# EAGLE design quadlighter-1.1 (EAGLE 5.12)
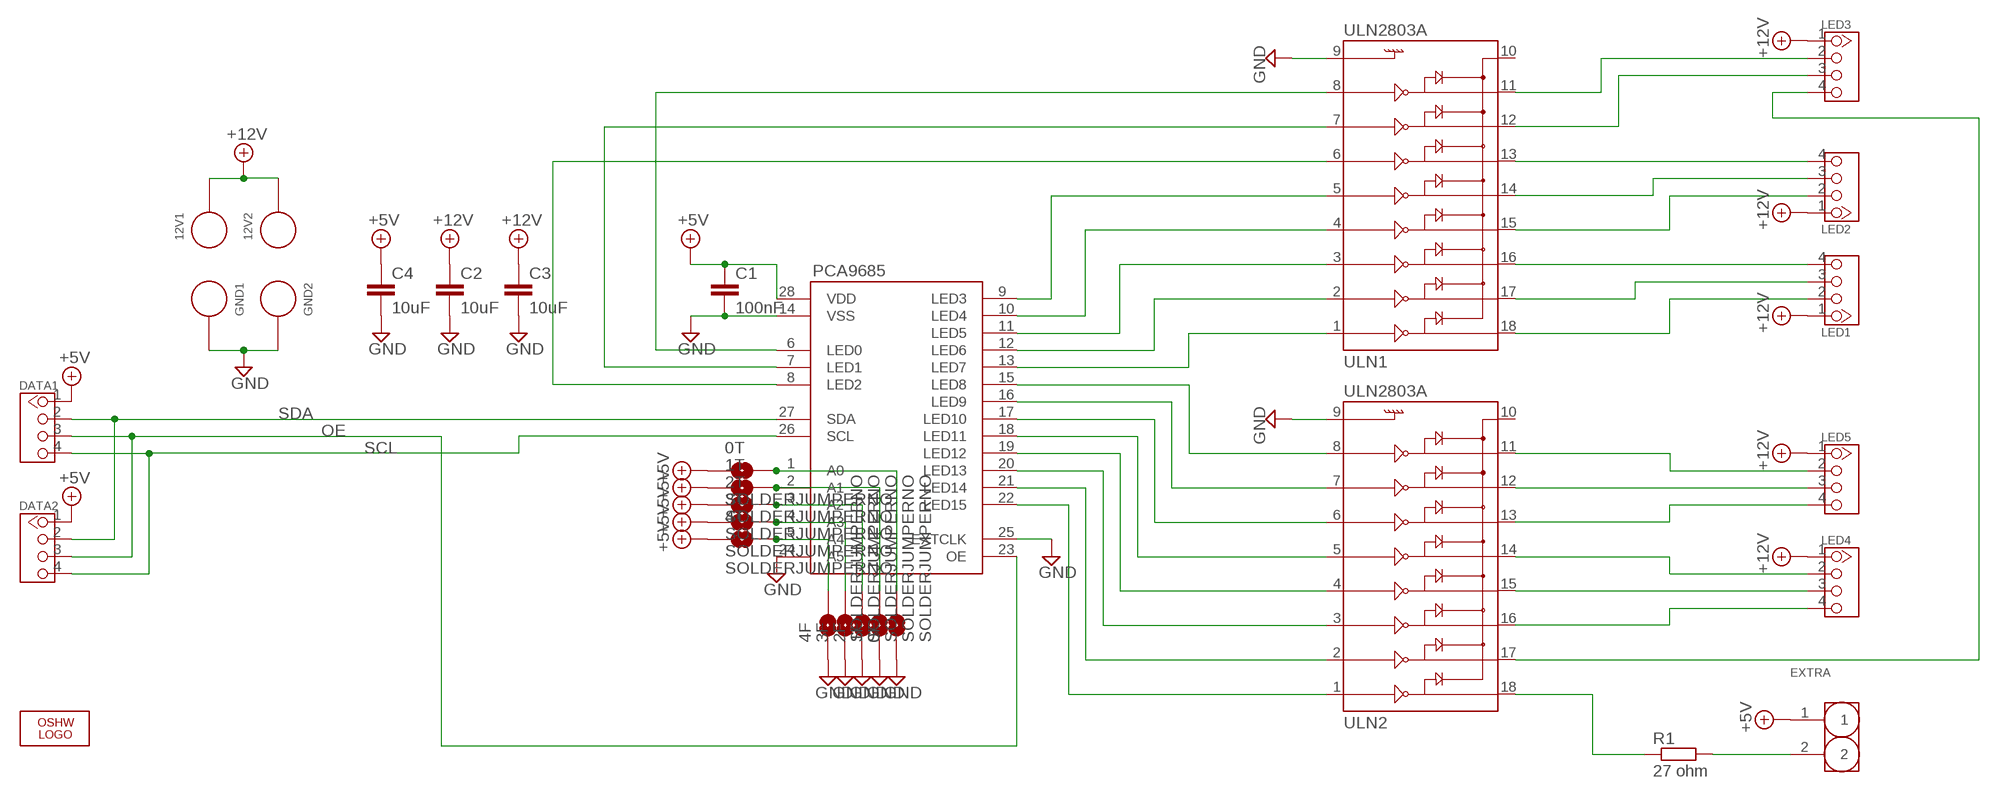
[diagram p0: schematic, sheet 1]

## Parts
0F  SOLDERJUMPERNO  [SJ_2S-NO]
0T  SOLDERJUMPERNO  [SJ_2S-NO]
1F  SOLDERJUMPERNO  [SJ_2S-NO]
1T  SOLDERJUMPERNO  [SJ_2S-NO]
2F  SOLDERJUMPERNO  [SJ_2S-NO]
2T  SOLDERJUMPERNO  [SJ_2S-NO]
3F  SOLDERJUMPERNO  [SJ_2S-NO]
3T  SOLDERJUMPERNO  [SJ_2S-NO]
4F  SOLDERJUMPERNO  [SJ_2S-NO]
4T  SOLDERJUMPERNO  [SJ_2S-NO]
12V1  LARGE_WIRE_PAD  [LARGE_WIRE_PAD_PACK]
12V2  LARGE_WIRE_PAD  [LARGE_WIRE_PAD_PACK]
C1  100nF  C-EUC3216  [C3216]
C2  10uF  C-EUC3216  [C3216]
C3  10uF  C-EUC3216  [C3216]
C4  10uF  C-EUC3216  [C3216]
DATA1  HEADER-4P-80/40MIL  [4P-2.54-80/40MIL]
DATA2  HEADER-4P-80/40MIL  [4P-2.54-80/40MIL]
EXTRA  HEADER-2P-2.54  [2P-2.54]
GND1  LARGE_WIRE_PAD  [LARGE_WIRE_PAD_PACK]
GND2  LARGE_WIRE_PAD  [LARGE_WIRE_PAD_PACK]
LED1  HEADER-4P-80/40MIL  [4P-2.54-80/40MIL]
LED2  HEADER-4P-80/40MIL  [4P-2.54-80/40MIL]
LED3  HEADER-4P-80/40MIL  [4P-2.54-80/40MIL]
LED4  HEADER-4P-80/40MIL  [4P-2.54-80/40MIL]
LED5  HEADER-4P-80/40MIL  [4P-2.54-80/40MIL]
LOGO1  LOGO-OSHW-6MILX0070-NT  [OSHW_6X70_NOTEXT]
PCA9685  PCA9685  [TSSOP28]
R1  27 ohm  R-EU_R1206  [R1206]
ULN1  ULN2803A  ULN2803SOICW  [SO18L]
ULN2  ULN2803A  ULN2803SOICW  [SO18L]

## Nets
+5V: 0T.1 1T.1 2T.1 3T.1 4T.1 C1.1 C4.1 DATA1.1 DATA2.1 EXTRA.1 PCA9685.28(VDD)
+12V: 12V1.P$1 12V2.P$1 C2.1 C3.1 LED1.1 LED2.1 LED3.1 LED4.1 LED5.1
GND: 0F.1 1F.1 2F.1 3F.1 4F.1 C1.2 C2.2 C3.2 C4.2 GND1.P$1 GND2.P$1 PCA9685.14(VSS) PCA9685.24(A5) PCA9685.25(EXTCLK) ULN1.9 ULN2.9
N$1: PCA9685.6(LED0) ULN1.8
N$2: PCA9685.7(LED1) ULN1.7
N$3: PCA9685.8(LED2) ULN1.6
N$4: PCA9685.9(LED3) ULN1.5
N$5: PCA9685.10(LED4) ULN1.4
N$6: PCA9685.11(LED5) ULN1.3
N$7: PCA9685.12(LED6) ULN1.2
N$8: PCA9685.13(LED7) ULN1.1
N$9: LED4.3 ULN2.15
N$10: LED5.3 ULN2.12
N$12: PCA9685.15(LED8) ULN2.8
N$13: PCA9685.16(LED9) ULN2.7
N$14: PCA9685.17(LED10) ULN2.6
N$15: PCA9685.18(LED11) ULN2.5
N$16: PCA9685.19(LED12) ULN2.4
N$17: PCA9685.20(LED13) ULN2.3
N$18: PCA9685.21(LED14) ULN2.2
N$19: PCA9685.22(LED15) ULN2.1
N$20: LED3.2 ULN1.11
N$21: LED2.2 ULN1.15
N$22: LED3.3 ULN1.12
N$23: LED2.4 ULN1.13
N$24: LED2.3 ULN1.14
N$25: 0F.2 0T.2 PCA9685.1(A0)
N$26: 1F.2 1T.2 PCA9685.2(A1)
N$27: 2F.2 2T.2 PCA9685.3(A2)
N$28: 3F.2 3T.2 PCA9685.4(A3)
N$29: 4F.2 4T.2 PCA9685.5(A4)
N$30: LED1.4 ULN1.16
N$31: LED3.4 ULN2.17
N$32: LED1.3 ULN1.17
N$33: EXTRA.2 R1.2
N$34: LED1.2 ULN1.18
N$35: R1.1 ULN2.18
N$36: LED4.4 ULN2.16
N$37: LED5.4 ULN2.13
N$38: LED4.2 ULN2.14
N$39: LED5.2 ULN2.11
OE: DATA1.3 DATA2.3 PCA9685.23(OE)
SCL: DATA1.4 DATA2.4 PCA9685.26(SCL)
SDA: DATA1.2 DATA2.2 PCA9685.27(SDA)
Unconnected: ULN1.10 ULN2.10

## Library data of the parts
0F 0T 1F 1T 2F 2T 3F 3T 4F 4T = SparkFun:SOLDERJUMPER: Solder Jumper Standard SMD solder jumper. Used to automate production. Two varients : Normally Open and Normally Closed are the same, but have different paste layers. NC will have a large amount of paste and should jumper during reflow.
12V1 12V2 GND1 GND2 = zzorn:LARGE_WIRE_PAD
C1-C4 = rcl:C-EU: CAPACITOR, European symbol
DATA1 DATA2 LED1-LED5 = Connector:HEADER-4P
EXTRA = Connector:HEADER-2P
LOGO1 = Logo:LOGO-OSHW-6MIL
PCA9685 = mylib:PCA9685
R1 = rcl:R-EU_: RESISTOR, European symbol
ULN1 ULN2 = SparkFun:ULN2803: Darlington Driver ULN2803 Darlington array. 500mA max per channel, 8-channel package. Spark Fun Electronics SKU : COM-00312

## Board
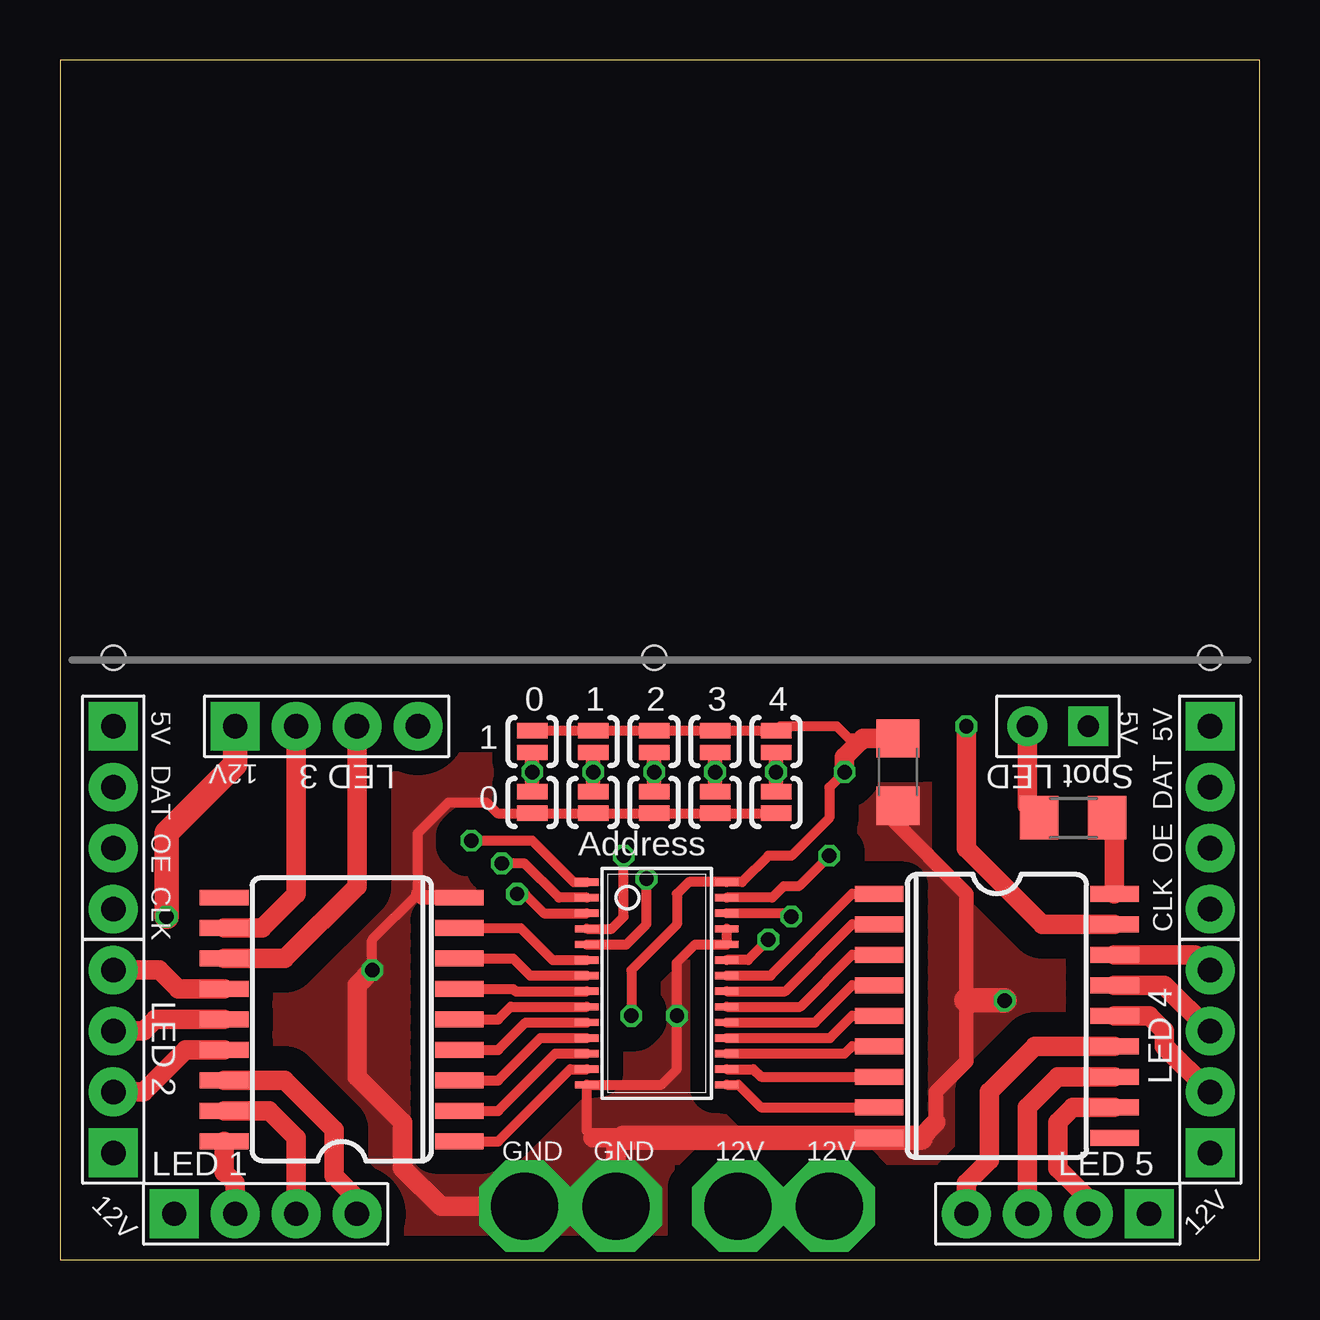
[diagram p1: board, top side]
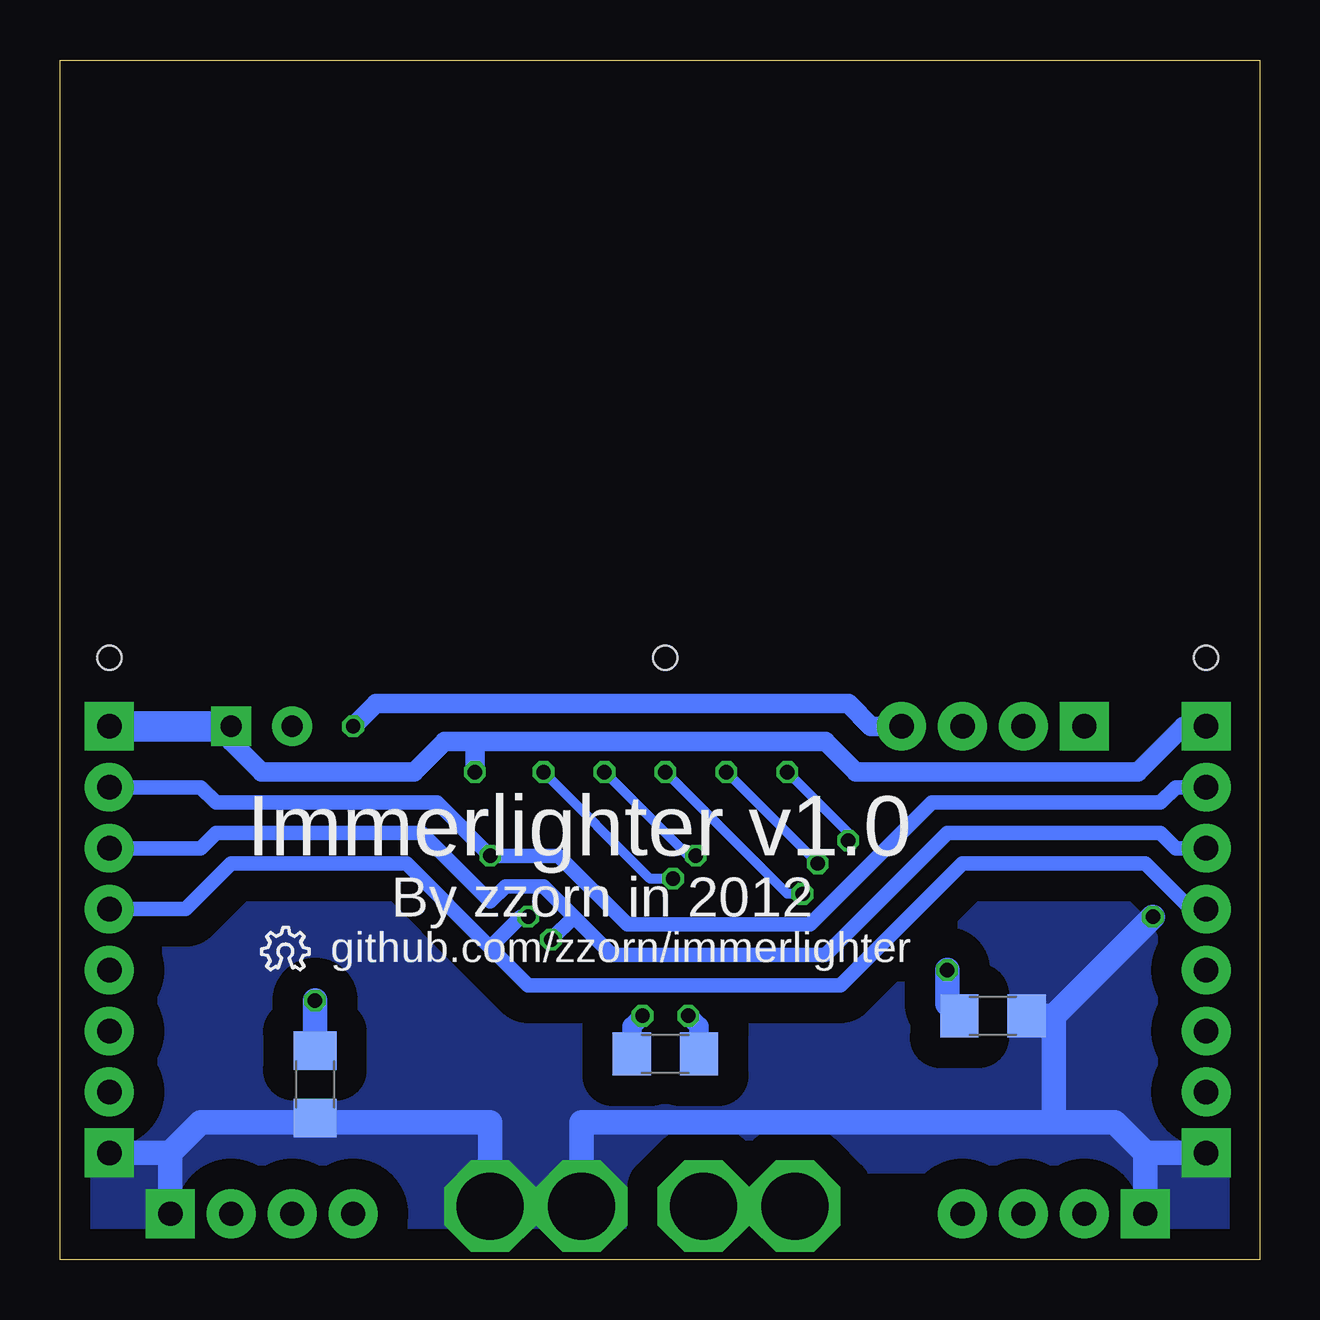
[diagram p2: board, bottom side, seen from below]

Size 50 x 50 mm. Coordinates in mm from the lower left corner, seen from the top.
Outline: 0,0 50,0 50,50 0,50 0,0
Copper layers (1*16): Top 0.035mm / dielectric 1.5mm / Bottom 0.035mm
Design rules "Fusion_eagle_rule_v1.1": minimum track width 6mil, minimum drill 12mil, track to track 6mil, track to pad 6mil, pad to pad 6mil, via to via 6mil, smd to smd 0mil, copper to edge 10mil, drill to drill 10mil, minimum pad ring 10mil, minimum via ring 6mil, stop-mask expansion 2mil, vias tented up to drill 100mil, thermal gap 10mil
Holes 1 mm at 2.22,25.08 24.77,25.08 47.94,25.08

### Footprints (pad centres in the part's own frame; a part is rotated, then mirrored left to right if it is on the bottom)
SJ_2S-NO = smd 0.635 x 1.27: 1 -0.45,0; 2 0.45,0
LARGE_WIRE_PAD_PACK = drill 2.8 pad 3.81 octagon: P$1 0,0
C3216 = smd 1.6 x 1.8: 1 -1.4,0; 2 1.4,0
4P-2.54-80/40MIL = drill 1.016 pad 2.032 square: 1 0,3.81 | drill 1.016 pad 2.032 round: 2 0,1.27; 3 0,-1.27; 4 0,-3.81
2P-2.54 = drill 0.889 pad 1.651 square: 1 0,1.27 | drill 0.889 pad 1.651 round: 2 0,-1.27
TSSOP28 = smd 0.305 x 0.991: 1 -4.225,-2.918; 2 -3.575,-2.918; 3 -2.925,-2.918; 4 -2.275,-2.918; 5 -1.625,-2.918; 6 -0.975,-2.918; 7 -0.325,-2.918; 8 0.325,-2.918; 9 0.975,-2.918; 10 1.625,-2.918; 11 2.275,-2.918; 12 2.925,-2.918; 13 3.575,-2.918; 14 4.225,-2.918; 15 4.225,2.918; 16 3.575,2.918; 17 2.925,2.918; 18 2.275,2.918; 19 1.625,2.918; 20 0.975,2.918; 21 0.325,2.918; 22 -0.325,2.918; 23 -0.975,2.918; 24 -1.625,2.918; 25 -2.275,2.918; 26 -2.925,2.918; 27 -3.575,2.918; 28 -4.225,2.918
R1206 = smd 1.6 x 1.803: 1 -1.422,0; 2 1.422,0
SO18L = smd 0.66 x 2.032: 1 -0.635,-4.902; 2 0.635,-4.902; 3 1.905,-4.902; 4 3.175,-4.902; 5 4.445,-4.902; 6 5.715,-4.902; 7 6.985,-4.902; 8 8.255,-4.902; 9 9.525,-4.902; 10 9.525,4.902; 11 8.255,4.902; 12 6.985,4.902; 13 5.715,4.902; 14 4.445,4.902; 15 3.175,4.902; 16 1.905,4.902; 17 0.635,4.902; 18 -0.635,4.902

### Placement (x,y rotation side)
0F  19.68,19.05 90 top
0T  19.68,21.59 270 top
1F  22.23,19.05 90 top
1T  22.23,21.59 270 top
2F  24.77,19.05 90 top
2T  24.77,21.59 270 top
3F  27.3,19.05 90 top
3T  27.3,21.59 270 top
4F  29.84,19.05 90 top
4T  29.84,21.59 270 top
12V1  32.07,2.22 0 top
12V2  28.26,2.22 0 top
C1  24.77,8.57 180 bottom
C2  39.37,7.3 90 bottom
C3  11.11,10.16 180 bottom
C4  34.92,20.32 270 top
DATA1  2.22,18.41 0 top
DATA2  47.94,18.41 0 top
EXTRA  41.59,22.23 270 top
GND1  19.37,2.22 0 top
GND2  23.18,2.22 0 top
LED1  8.57,1.91 90 top
LED2  2.22,8.26 180 top
LED3  11.11,22.23 90 top
LED4  47.94,8.26 180 top
LED5  41.59,1.91 270 top
LOGO1  41.59,12.06 0 bottom
PCA9685  24.88,11.51 270 top
R1  42.23,18.41 180 top
ULN1  11.75,5.56 90 top
ULN2  39.05,14.61 270 top

### Tracks (layer width: path | path; a pad name or v marks a point on that pad's centre or on a via)
+5V  (via drill 0.6)
  Top 0.406: 0T.1 1T.1 2T.1 3T.1 4T.1 30.03,22.23 32.38,22.23 32.89,21.72 33.21,21.72 33.34,21.59 | v23.81,10.16 23.81,12.06 25.72,13.97 25.72,15.24 26.21,15.73 PCA9685.28 28.43,15.73 29.53,16.83 30.48,16.83 32.07,18.41 32.07,19.68 v32.7,20.32
  Top 0.813: C4.1 33.47,21.72 33.34,21.59 32.7,20.95 v32.7,20.32
  Bottom 0.813: 32.7,21.59 33.97,21.59 35.24,20.32 41.59,20.32 42.86,21.59 EXTRA.1 | 32.7,21.59 18.1,21.59 16.83,20.32 5.08,20.32 3.17,22.23 DATA1.1 | 32.7,21.59 v32.7,20.32 | C1.1 23.36,9.71 v23.81,10.16
  Bottom 1.27: EXTRA.1 DATA2.1
+12V  (via drill 0.6)
  Top 1.016: LED3.1 7.3,20.64 4.45,17.78 v4.45,14.29
  Bottom 0.813: C3.1 9.84,10.29
  Bottom 1.016: 8.57,10.16 v4.45,14.29 | 8.57,10.16 C3.1 | 4.76,4.45 LED1.1 | 4.76,4.45 6.03,5.71 8.26,5.71 | 8.57,10.16 8.57,6.03 8.26,5.71 | 45.4,4.45 LED5.1 | 45.4,4.45 44.13,5.71 39.56,5.71 C2.1 39.18,5.71 32.07,5.71 12V1.P$1 12V2.P$1 28.26,5.71 8.26,5.71 | 45.4,4.45 LED4.1 | LED2.1 4.76,4.45
  pour Bottom (isolate 1.27, no thermals): 0.32,21.27 49.53,21.27 49.21,0 17.46,0 17.46,3.81 12.7,3.81 12.7,0.32 0.32,0.32
GND  (via drill 0.6)
  Top 0.406: 4F.1 3F.1 2F.1 1F.1 0F.1 18.23,18.6 17.78,19.05 16.19,19.05 14.92,17.78 14.92,15.24 13.02,13.34 v13.02,12.06 | 34.6,18.6 C4.2 | 22.23,5.08 21.96,5.34 PCA9685.14 25.07,7.29 25.72,7.94 v25.72,10.16 25.72,12.38 26.47,13.13 PCA9685.24 PCA9685.25
  Top 0.61: 34.6,18.6 34.6,18.42 37.78,15.24 37.78,10.79 37.78,8.26 36.51,6.99 36.51,5.71 | 35.88,5.08 ULN2.9 | ULN1.9 15.08,15.09 14.92,15.24
  Top 0.813: v13.02,12.06 12.38,11.43 12.38,7.62 14.29,5.71 14.29,3.81 15.88,2.22 GND1.P$1 GND2.P$1 23.18,5.08 | 23.18,5.08 22.23,5.08 | 23.18,5.08 23.5,5.08 | 35.88,5.08 36.51,5.71
  Top 1.016: 37.78,10.79 v39.37,10.79 | 23.5,5.08 35.88,5.08
  Bottom 0.813: C1.2 26.16,9.71 v25.72,10.16
  Bottom 1.016: v13.02,12.06 13.02,10.66 C3.2 | v39.37,10.79 C2.2
  pour Top (isolate 1.016, no thermals): 0.32,20.95 49.53,20.95 49.21,0.32 37.78,0.32 37.78,4.13 25.4,4.13 25.4,0 0.32,0
N$1
  Top 0.406: PCA9685.6 20.54,12.48 19.2,13.82 ULN1.8
N$2
  Top 0.406: PCA9685.7 19.6,11.84 18.89,12.55 ULN1.7
N$3
  Top 0.406: PCA9685.8 18.98,11.19 18.89,11.28 ULN1.6
N$4
  Top 0.406: PCA9685.9 18.79,10.54 18.26,10.01 ULN1.5
N$5
  Top 0.406: PCA9685.10 19.41,9.88 18.26,8.74 ULN1.4
N$6
  Top 0.406: PCA9685.11 20.03,9.23 18.26,7.47 ULN1.3
N$7
  Top 0.406: PCA9685.12 20.65,8.59 18.26,6.2 ULN1.2
N$8
  Top 0.406: PCA9685.13 21.27,7.93 18.26,4.93 ULN1.1
N$9
  Top 0.813: ULN2.15 46.04,11.43 LED4.3
N$10
  Top 0.813: ULN2.12 41.59,7.62 40.32,6.35 LED5.3
N$12
  Top 0.406: PCA9685.15 28.27,7.29 29.21,6.35 ULN2.8
N$13
  Top 0.406: PCA9685.16 28.89,7.93 29.21,7.62 ULN2.7
N$14
  Top 0.406: PCA9685.17 32.72,8.59 33.02,8.89 ULN2.6
N$15
  Top 0.406: PCA9685.18 32.09,9.23 33.02,10.16 ULN2.5
N$16
  Top 0.406: PCA9685.19 31.48,9.88 33.02,11.43 ULN2.4
N$17
  Top 0.406: PCA9685.20 30.86,10.54 33.02,12.7 ULN2.3
N$18
  Top 0.406: PCA9685.21 30.23,11.19 33.02,13.97 ULN2.2
N$19
  Top 0.406: PCA9685.22 29.61,11.84 33.02,15.24 ULN2.1
N$20
  Top 0.813: ULN1.11 8.42,13.82 9.84,15.24 LED3.2
N$21
  Top 0.813: ULN1.15 5.24,8.74 3.49,6.99 LED2.2
N$22
  Top 0.813: ULN1.12 9.37,12.55 12.38,15.56 LED3.3
N$23
  Top 0.813: ULN1.13 4.92,11.28 4.13,12.06 LED2.4
N$24
  Top 0.813: ULN1.14 3.97,10.01 3.49,9.53 LED2.3
N$25  (via drill 0.6)
  Top 0.406: PCA9685.1 21.41,15.73 19.68,17.46 v17.14,17.46
  Top 0.61: 0T.2 v19.68,20.32 0F.2
  Bottom 0.406: v17.14,17.46 17.14,17.78 v19.68,20.32
N$26  (via drill 0.6)
  Top 0.406: PCA9685.2 20.79,15.09 19.37,16.51 v18.41,16.51
  Top 0.61: 1T.2 v22.23,20.32 1F.2
  Bottom 0.406: v18.41,16.51 v22.23,20.32
N$27  (via drill 0.6)
  Top 0.406: PCA9685.3 20.17,14.44 19.37,15.24 v19.05,15.24
  Top 0.61: 2T.2 v24.77,20.32 2F.2
  Bottom 0.406: v19.05,15.24 19.68,15.24 v24.77,20.32
N$28  (via drill 0.6)
  Top 0.406: PCA9685.4 22.99,13.79 23.5,14.29 v23.5,16.83
  Top 0.61: 3T.2 v27.3,20.32 3F.2
  Bottom 0.406: v23.5,16.83 23.81,16.83 v27.3,20.32
N$29  (via drill 0.6)
  Top 0.406: PCA9685.5 23.61,13.13 24.45,13.97 v24.45,15.88
  Top 0.61: 4T.2 v29.84,20.32 4F.2
  Bottom 0.406: v24.45,15.88 25.4,15.88 v29.84,20.32
N$30
  Top 0.813: ULN1.16 9.36,7.47 11.43,5.4 11.43,3.49 12.38,2.54 LED1.4
N$31  (via drill 0.6)
  Top 0.813: ULN2.17 40.96,13.97 37.78,17.14 v37.78,22.23
  Bottom 0.813: v37.78,22.23 36.83,23.18 17.14,23.18 16.19,22.23 LED3.4
N$32
  Top 0.813: ULN1.17 8.73,6.2 9.84,5.08 LED1.3
N$33
  Top 0.813: EXTRA.2 40.32,18.9 R1.2
N$34
  Top 0.813: ULN1.18 6.84,3.63 7.3,3.17 LED1.2
N$35
  Top 0.813: ULN2.18 43.95,18.11 R1.1
N$36
  Top 0.813: ULN2.16 47.31,12.7 LED4.4
N$37
  Top 0.813: ULN2.13 40.64,8.89 38.73,6.99 38.73,4.13 37.78,3.17 LED5.4
N$38
  Top 0.813: ULN2.14 45.4,10.16 46.04,9.53 46.04,8.89 LED4.2
N$39
  Top 0.813: ULN2.11 42.23,6.35 41.59,5.71 41.59,3.81 42.86,2.54 LED5.2
OE  (via drill 0.6)
  Top 0.406: PCA9685.23 28.68,12.48 v29.53,13.34
  Bottom 0.61: DATA1.3 3.49,17.14 4.13,17.78 13.02,17.78 18.1,12.7 26.99,12.7 28.57,14.29 | 28.57,14.29 29.84,15.56 31.43,15.56 32.07,14.92 34.92,17.78 43.5,17.78 44.13,17.14 DATA2.3 | 28.57,14.29 v29.53,13.34
SCL  (via drill 0.6)
  Top 0.406: PCA9685.26 30.33,14.44 v30.48,14.29
  Bottom 0.61: DATA1.4 2.86,14.61 4.76,16.51 12.38,16.51 17.46,11.43 30.48,11.43 32.07,13.02 | DATA2.4 44.77,14.61 42.86,16.51 35.56,16.51 32.07,13.02 | v30.48,14.29 30.8,14.29 32.07,13.02
SDA  (via drill 0.6)
  Top 0.406: PCA9685.27 29.69,15.09 30.16,15.56 30.8,15.56 v32.07,16.83
  Bottom 0.61: DATA1.2 3.49,19.68 4.13,19.05 13.65,19.05 18.73,13.97 26.35,13.97 29.21,16.83 v32.07,16.83 34.29,19.05 43.5,19.05 44.13,19.68 DATA2.2

### Text on the board
tNames: 5V | 0 | 1 | 2 | 3 | 4 | 5V | 5V | DAT | 12V | LED 3 | 1 | Spot LED | 0 | DAT | OE | Address | OE | CLK | CLK | LED 2 | LED 4 | GND | GND | 12V | 12V | LED 1 | LED 5 | 12V | 12V
bNames: Immerlighter v1.0 | By zzorn in 2012 | github.com/zzorn/immerlighter